# EAGLE design RdL_main_v03_simple (EAGLE 7.6.0)
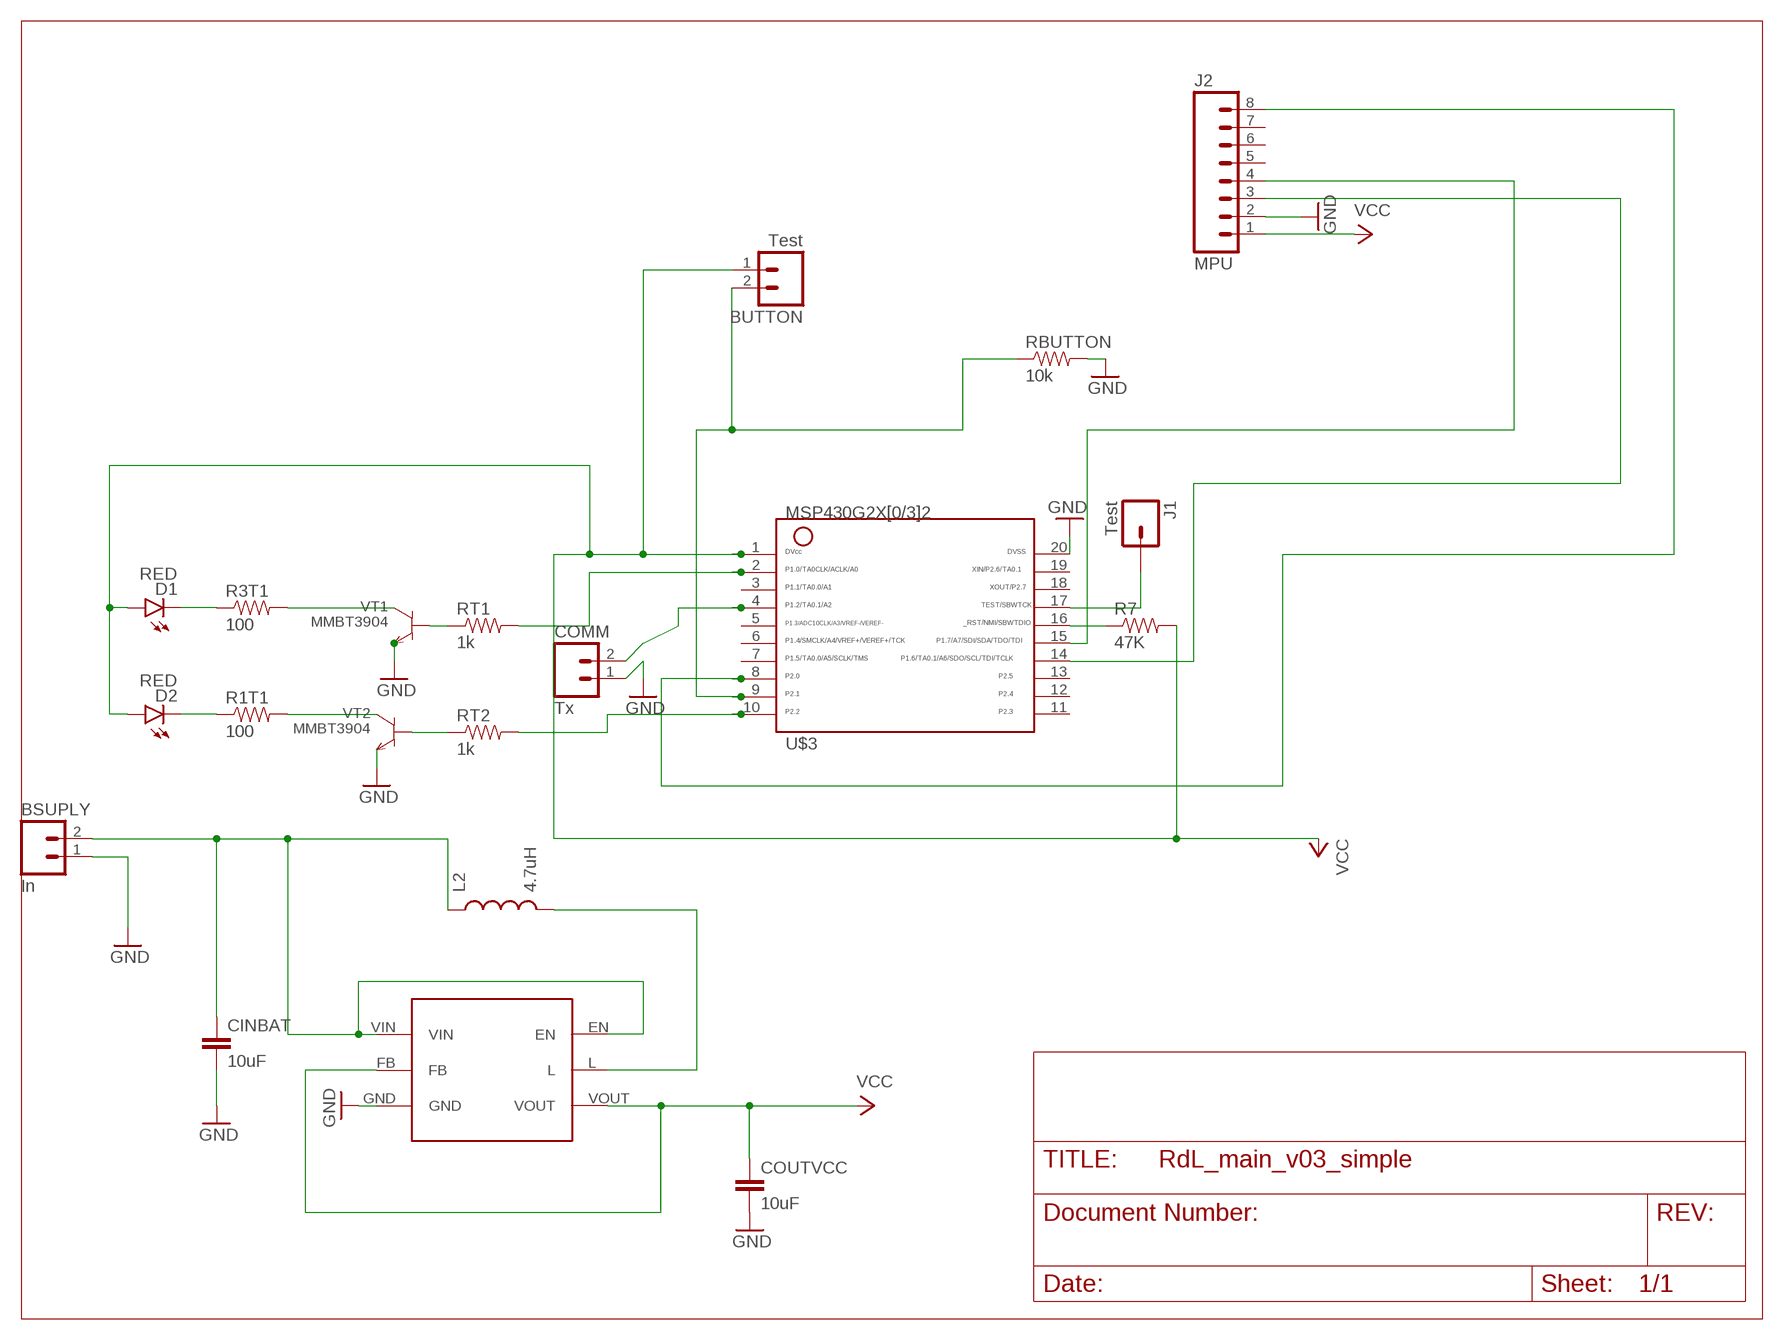
[diagram p0: schematic, sheet 1]

## Parts
BSUPLY  In  M02PTH  [1X02]
BUTTON  Test  M02PTH  [1X02]
CINBAT  10uF  CAP0805  [0805]
COMM  Tx  M02PTH  [1X02]
COUTVCC  10uF  CAP0805  [0805]
D1  RED  LED-RED1206  [LED-1206]
D2  RED  LED-RED1206  [LED-1206]
J1  Test  M01PTH  [1X01]
J2  MPU  M08NO_SILK  [1X08_PIN1_NO_SILK]
L2  4.7uH  INDUCTORINDUCTOR_4.7UH  [INDUCTOR_4.7UH]
R1T1  100  RESISTOR1206  [1206]
R3T1  100  RESISTOR1206  [1206]
R7  47K  47KOHM1/10W1%(0603)  [0603-RES]
RBUTTON  10k  RESISTOR0805-RES  [0805]
RT1  1k  RESISTOR1206  [1206]
RT2  1k  RESISTOR1206  [1206]
U$1  TLV61225  [TLV61225DCKT]
U$3  G2X[0/3]2---PW20  [PW20]
VT1  MMBT3904  [SOT23-BEC]
VT2  MMBT3904  [SOT23-BEC]

## Nets
GND: BSUPLY.1 CINBAT.2 COMM.1 COUTVCC.2 J2.2 RBUTTON.2 U$1.GND U$3.20 VT1.E VT2.E
N$1: BUTTON.2 RBUTTON.1 U$3.9
N$2: BSUPLY.2 CINBAT.1 L2.P$1 U$1.EN U$1.VIN
N$3: L2.P$2 U$1.L
N$4: J1.1 U$3.17
N$6: R1T1.2 VT2.C
N$7: R3T1.2 VT1.C
N$8: RT1.1 VT1.B
N$9: RT2.1 VT2.B
N$10: RT1.2 U$3.2
N$11: RT2.2 U$3.10
N$12: R7.1 U$3.16
N$13: D2.C R1T1.1
N$14: D1.C R3T1.1
N$15: COMM.2 U$3.4
N$18: J2.8 U$3.8
N$20: J2.4 U$3.15
N$22: J2.3 U$3.14
VCC: BUTTON.1 COUTVCC.1 D1.A D2.A J2.1 R7.2 U$1.FB U$1.VOUT U$3.1
Unconnected: J2.5 J2.6 J2.7 U$3.3 U$3.5 U$3.6 U$3.7 U$3.11 U$3.12 U$3.13 U$3.18 U$3.19

## Library data of the parts
BSUPLY BUTTON COMM = SparkFun-Connectors:M02: Standard 2-pin 0.1" header. Use with - straight break away headers ( PRT-00116) - right angle break away headers (PRT-00553) - swiss pins (PRT-00743) - machine pins (PRT-00117) - female headers (PRT-00115) Molex polarized connector foot print use with: PRT-08233 with associated crimp pins and housings. 2.54_SCREWTERM for use with PRT-10571. 3.5mm Screw Terminal footprints for PRT-08084 5mm Screw Terminal footprints for use with PRT-08432
CINBAT COUTVCC = SparkFun-Capacitors:CAP: Capacitor Standard 0603 ceramic capacitor, and 0.1" leaded capacitor.
D1 D2 = SparkFun-LED:LED-RED: Assorted Red LEDs LilyPad 1206- DIO-09912 1206- DIO-00809 0603- DIO-00819 "SMART" means more efficient and expensive; PROD_ID: DIO-09912
J1 = SparkFun-Connectors:M01: Header 1 Standard 1-pin 0.1" header. Use with straight break away headers (SKU : PRT-00116), right angle break away headers (PRT-00553), swiss pins (PRT-00743), machine pins (PRT-00117), and female headers (PRT-00115). SMTSO-256-ET is a "flush mount" nut for a 4-40 screw. The older package used to be too tight, and did not allow it to sit properly thru the drill hit. The latest (0.165DIA) fits nice and snug.
J2 = SparkFun-Connectors:M08: Header 8 Standard 8-pin 0.1" header. Use with straight break away headers (SKU : PRT-00116), right angle break away headers (PRT-00553), swiss pins (PRT-00743), machine pins (PRT-00117), and female headers (PRT-00115).
L2 = SparkFun-Passives:INDUCTOR: Inductors Basic Inductor/Choke - 0603 and 1206. Footprints are not proven and vary greatly between part numbers. INDUCTOR POWER 3.3UH 4.0A SMD 0.197" L x 0.197" W x 0.177" H (5.00mm x 5.00mm x 4.50mm); PROD_ID: NDUC-10146
R1T1 R3T1 RBUTTON RT1 RT2 = SparkFun-Resistors:RESISTOR: Resistor Basic schematic elements and footprints for 0603, 1206, and PTH resistors.
R7 = SparkFun-Resistors:47KOHM1/10W1%(0603): RES-07871; PROD_ID: RES-07871
U$1 = TLV61225DCKT:TLV61225: TLV61225 Single-Cell High-Efficient Step-up Converter
U$3 = TI_MSP430_v16:G2X[0/3]2---PW20: MSP430G2X[0/3]2 MSP430G2x32, MSP430G2x02 TSSOP (PW) 20 Pin Package http://focus.ti.com/docs/prod/folders/print/msp430g2432.html
VT1 VT2 = transistor-npn:MMBT3904*: NPN TRANSISTOR

## Net classes
0 default: clearance 0.205 mm

## Board
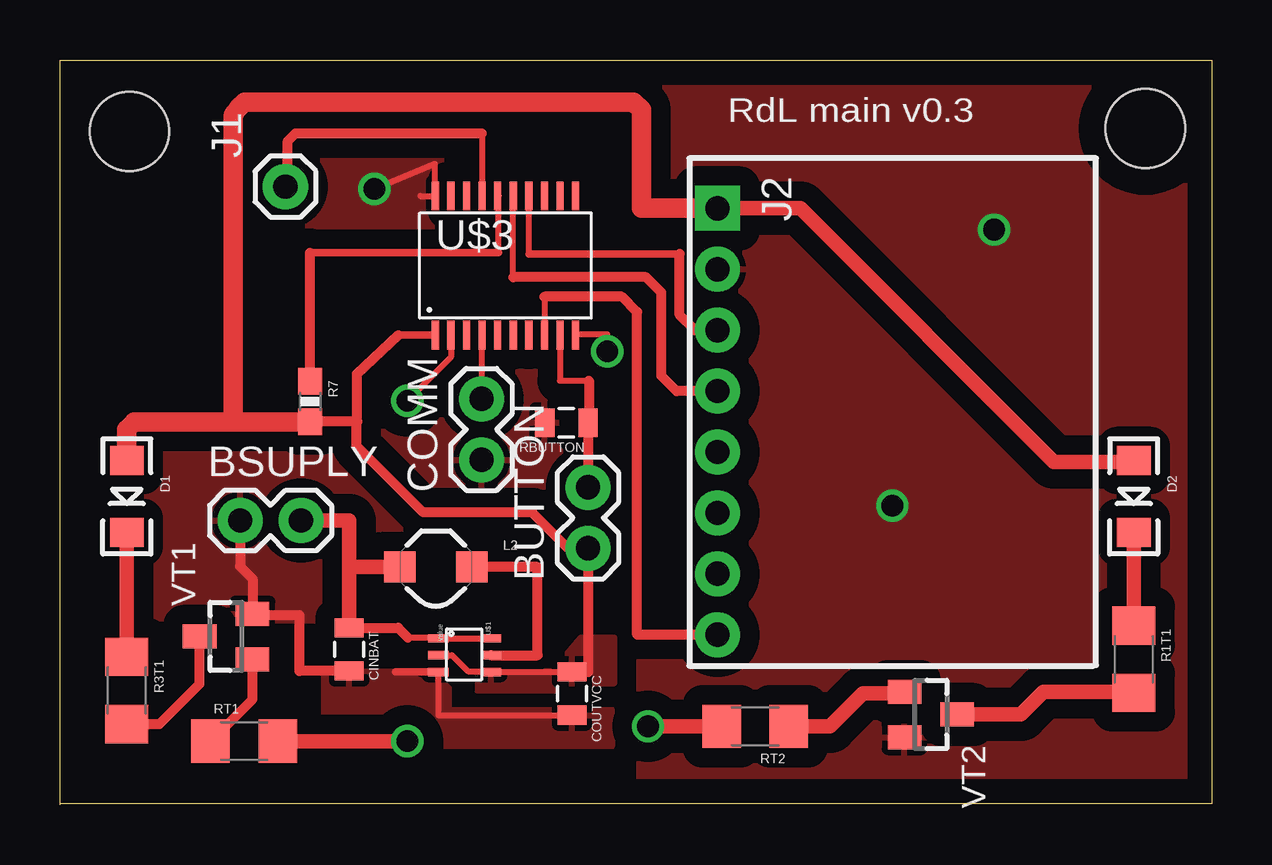
[diagram p1: board, top side]
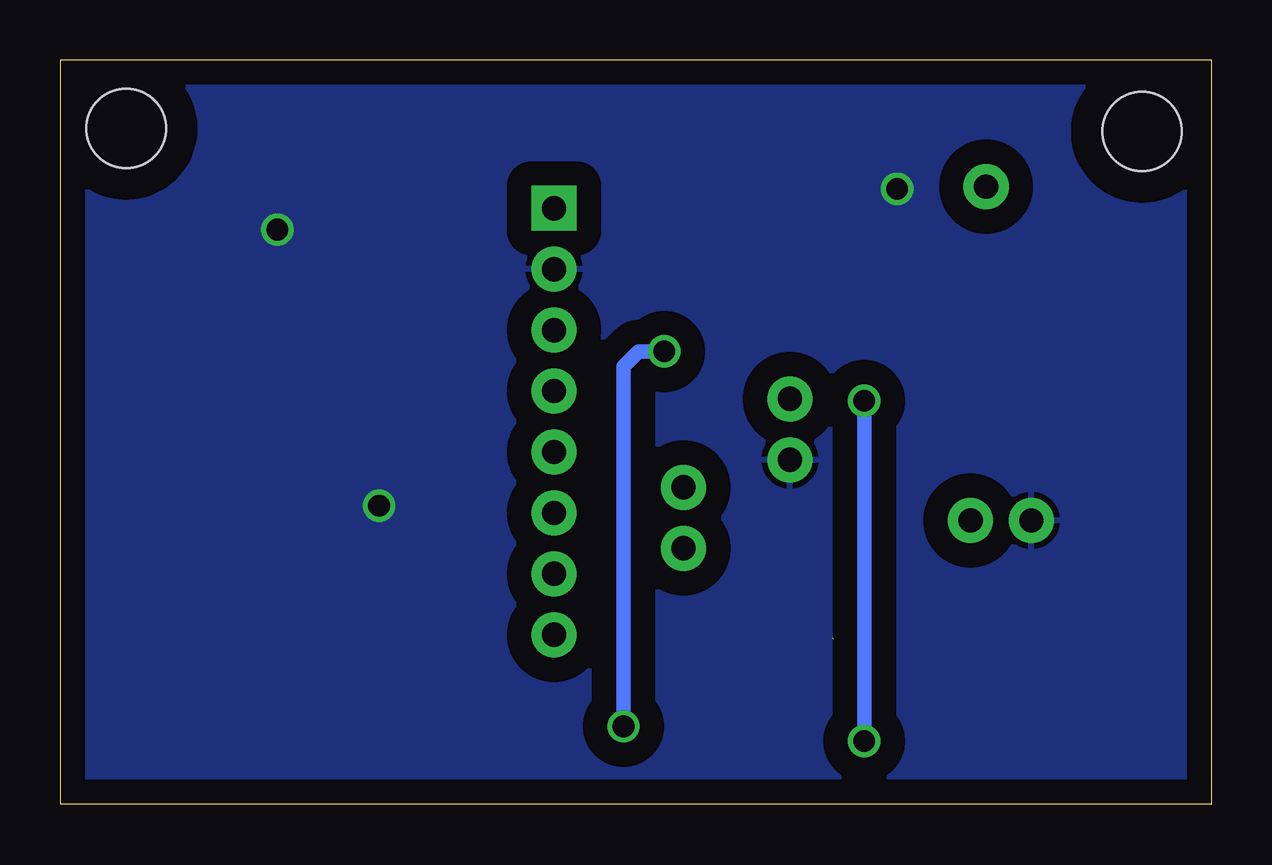
[diagram p2: board, bottom side, seen from below]

Size 48 x 31.05 mm. Coordinates in mm from the lower left corner, seen from the top.
Outline: 0,0 0,0.05
Outline: 0,0.05 0,31.05 48,31.05 48,0.05 0,0.05
Copper layers (1*16): Top 0.035mm / dielectric 1.5mm / Bottom 0.035mm
Design rules "default *": minimum track width 10mil, minimum drill 22mil, track to track 8mil, track to pad 8mil, pad to pad 8mil, via to via 8mil, smd to smd 8mil, copper to edge 40mil, drill to drill 8mil, minimum pad ring 10mil, minimum via ring 8mil, stop-mask expansion 4mil, vias tented up to drill 0mil, thermal gap 10mil

### Footprints (pad centres in the part's own frame; a part is rotated, then mirrored left to right if it is on the bottom)
1X02 = drill 1.016 pad 1.88: 1 0,0; 2 2.54,0
0805 = smd 0.8 x 1.2: 1 -0.9,0; 2 0.9,0
LED-1206 = smd 1.2 x 1.4: A -1.5,0; C 1.5,0
STAND-OFF = hole 3.302: 0,0
1X01 = drill 1.016 pad 1.88: 1 0,0
1X08_PIN1_NO_SILK = drill 1.016 pad 1.88 square: 1 0,0 | drill 1.016 pad 1.88: 2 2.54,0; 3 5.08,0; 4 7.62,0; 5 10.16,0; 6 12.7,0; 7 15.24,0; 8 17.78,0
INDUCTOR_4.7UH = smd 1.3 x 1.3: P$1 -1.5,0; P$2 1.5,0
1206 = smd 1.6 x 1.8: 1 -1.4,0; 2 1.4,0
0603-RES = smd 1.1 x 1: 1 -0.85,0; 2 0.85,0
TLV61225DCKT = smd 0.35 x 0.85: EN -3,2.2; FB -2.3,0; GND -1.6,0; L -2.3,2.2; VIN -3,0; VOUT -1.6,2.2
PW20 = smd 0.3 x 1.2: 1 -2.925,-2.9; 2 -2.275,-2.9; 3 -1.625,-2.9; 4 -0.975,-2.9; 5 -0.325,-2.9; 6 0.325,-2.9; 7 0.975,-2.9; 8 1.625,-2.9; 9 2.275,-2.9; 10 2.925,-2.9; 11 2.925,2.9; 12 2.275,2.9; 13 1.625,2.9; 14 0.975,2.9; 15 0.325,2.9; 16 -0.325,2.9; 17 -0.975,2.9; 18 -1.625,2.9; 19 -2.275,2.9; 20 -2.925,2.9
SOT23-BEC = smd 1 x 1.4: B -0.95,-1.1; C 0,1.1; E 0.95,-1.1

### Placement (x,y rotation side)
BSUPLY  7.51,11.85 0 top
BUTTON  22.01,10.69 90 top
CINBAT  12.05,6.48 270 top
COMM  17.57,14.38 90 top
COUTVCC  21.34,4.64 270 top
D1  2.78,12.85 270 top
D2  44.76,12.85 270 top
H1  STAND-OFF  [STAND-OFF]  2.9,28.07 0 top
H3  STAND-OFF  [STAND-OFF]  45.24,28.19 0 top
J1  9.4,25.77 90 top
J2  27.41,24.87 270 top
L2  15.67,9.92 0 top
R1T1  44.76,6.06 270 top
R3T1  2.78,4.77 270 top
R7  10.42,16.81 270 top
RBUTTON  21.11,15.93 180 top
RT1  7.68,2.65 0 top
RT2  28.98,3.27 180 top
U$1  15.76,3.94 270 top
U$3  18.57,22.48 0 top
VT1  6.92,7.02 90 top
VT2  36.3,3.76 270 top

### Tracks (layer width: path | path; a pad name or v marks a point on that pad's centre or on a via)
GND  (via drill 0.9)
  Top 0.254: U$1.GND 15.77,3.74 COUTVCC.2 | v13.11,25.68 15.62,26.72 15.62,25.38 U$3.20 | 15.01,25.37 15.67,25.37
  Top 0.305: 15.62,5.54 13.99,5.54
  Top 0.406: CINBAT.2 9.98,5.58 9.98,7.9 8.02,7.9 VT1.E 8.03,9.42 7.51,9.94 BSUPLY.1
  other vias: 38.94,23.98 34.7,12.47
  pour Top (isolate 0.813): 11,5.57 16.2,5.57 16.2,3.97 23,3.97 23,2.43 11,2.43
  pour Bottom (isolate 1.016): 0.03,29.97 0.03,0.13 47.96,0.13 47.96,29.97
  pour Top (isolate 0.813): 0.03,30.02 0.03,7.7 24.13,7.7 24.13,0.05 47.96,0.05 47.96,30.02
N$1
  Top 0.254: U$3.9 20.84,17.68 22.05,17.68
  Top 0.406: 22.05,17.68 22.05,15.93 RBUTTON.1 BUTTON.2
N$2  (1 unrouted)
  Top 0.254: U$1.VIN U$1.EN | 15.8,6.97 14.51,6.97
  Top 0.406: CINBAT.1 14.1,7.38 14.51,6.97
  Top 0.61: L2.P$1 12.05,9.92 | 12.05,9.92 CINBAT.1 | BSUPLY.2 12.05,11.85 12.05,9.92
N$3
  Top 0.406: U$1.L 19.91,6.24 19.91,9.91 17.29,9.91 L2.P$2
N$4
  Top 0.254: 17.59,27.99 U$3.17
  Top 0.406: J1.1 9.5,25.87 9.5,27.67 9.82,27.99 17.59,27.99
N$6
  Top 0.406: 44.73,4.7 R1T1.2
  Top 0.61: VT2.C 40.06,3.76 41,4.7 44.73,4.7
N$7
  Top 0.406: R3T1.2 4.15,3.37 5.82,5.03 VT1.C
N$8
  Top 0.406: RT1.1 8.02,4.4 VT1.B
N$9
  Top 0.254: 35.13,4.65 VT2.B
  Top 0.61: RT2.1 32.1,3.27 33.48,4.65 35.13,4.65
N$10  (via drill 0.9)
  Top 0.254: U$3.2 16.29,18.65 v14.48,16.84
  Top 0.61: v14.48,2.65 RT1.2
  Bottom 0.61: v14.48,16.84 v14.48,2.65
N$11  (via drill 0.9)
  Top 0.254: v22.81,18.9 22.81,19.61 21.49,19.61 U$3.10
  Top 0.61: RT2.2 v24.51,3.27
  Bottom 0.61: v24.51,3.27 24.51,18.26 23.88,18.9 v22.81,18.9
N$12
  Top 0.254: 18.29,23.01 18.29,25.38 U$3.16
  Top 0.305: 10.42,23.01 18.29,23.01
  Top 0.406: R7.1 10.42,23.01
N$13
  Top 0.61: D2.C R1T1.1
N$14
  Top 0.61: R3T1.1 D1.C
N$15
  Top 0.254: U$3.4 17.57,19.58 COMM.2
N$18
  Top 0.254: 20.19,21.18 U$3.8
  Top 0.406: J2.8 24.05,7.09 24.05,20.55 23.42,21.18 20.19,21.18
N$20
  Top 0.254: 18.89,22 U$3.15
  Top 0.406: J2.4 25.7,17.25 25.07,17.88 25.07,21.36 24.43,22 18.89,22
N$22
  Top 0.254: 19.54,22.96 U$3.14
  Top 0.305: 25.83,22.96 19.54,22.96
  Top 0.406: J2.3 26.47,19.79 25.83,20.42 25.83,22.96
VCC
  Top 0.254: COUTVCC.1 U$1.VOUT 17.93,5.57 17,5.57 16.34,6.24 U$1.FB
  Top 0.305: U$3.1 14.1,19.58
  Top 0.406: 44.71,14.3 D2.A | COUTVCC.1 22.01,5.54 BUTTON.1 21.19,10.69 19.68,12.19 15.14,12.19 12.37,14.96 12.37,15.95 12.39,15.98 | 12.39,15.98 10.44,15.98 R7.2 | 14.1,19.58 12.37,17.96 12.37,16.05 12.39,15.98
  Top 0.61: J2.1 30.86,24.87 41.43,14.3 44.71,14.3
  Top 0.813: D1.A 2.79,15.64 3.1,15.96 7.21,15.96 | 7.21,15.96 R7.2 | J2.1 24.23,24.87 24.23,28.97 23.91,29.29 7.72,29.29 7.7,29.28 7.45,29.07 7.26,28.82 7.21,28.71 7.21,15.96
  pour Top (isolate 0.406): 17.4,5.57 17.4,4.77 20.6,4.77 20.6,5.07 23.1,5.07 23.1,6.97 21.7,6.97 20.5,5.57

### Text on the board
tPlace: RdL main v0.3